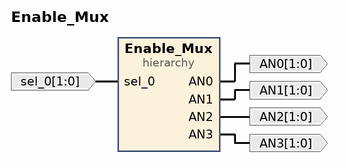
[diagram p0: block diagram of the top level]
# Vivado block design Enable_Mux, xc7a35tcpg236-1, Vivado 2018.3
create_bd_design Enable_Mux

create_bd_port -dir I -from 1 -to 0 sel_0
create_bd_port -dir O -from 1 -to 0 AN0
create_bd_port -dir O -from 1 -to 0 AN1
create_bd_port -dir O -from 1 -to 0 AN2
create_bd_port -dir O -from 1 -to 0 AN3

create_bd_cell -type hier Enable_Mux

# ---- hierarchy /Enable_Mux ----
current_bd_instance /Enable_Mux
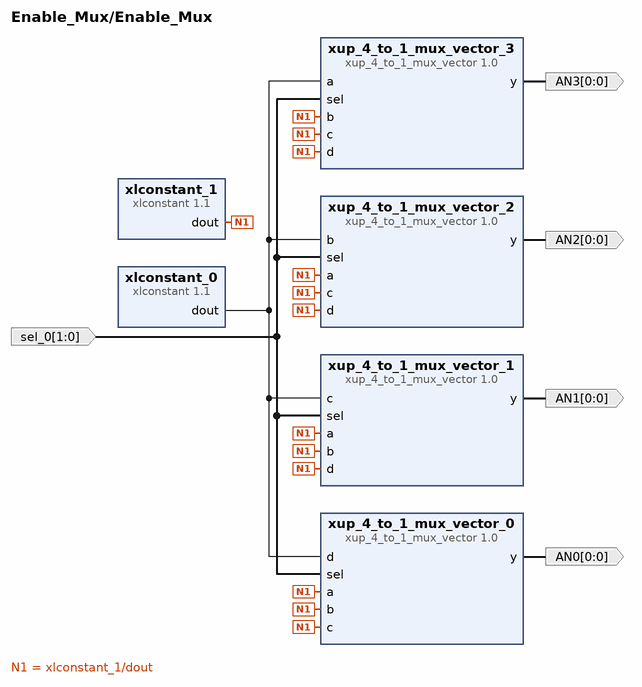
[diagram p1: block diagram inside /Enable_Mux]
create_bd_pin -dir I -from 1 -to 0 sel_0
create_bd_pin -dir O -from 0 -to 0 AN1
create_bd_pin -dir O -from 0 -to 0 AN2
create_bd_pin -dir O -from 0 -to 0 AN3
create_bd_pin -dir O -from 0 -to 0 AN0

create_bd_cell -type ip -vlnv xilinx.com:xup:xup_4_to_1_mux_vector:1.0 xup_4_to_1_mux_vector_1
set_property -dict {CONFIG.DELAY 0 CONFIG.SIZE 1} [get_bd_cells xup_4_to_1_mux_vector_1]
create_bd_cell -type ip -vlnv xilinx.com:xup:xup_4_to_1_mux_vector:1.0 xup_4_to_1_mux_vector_2
set_property -dict {CONFIG.DELAY 0 CONFIG.SIZE 1} [get_bd_cells xup_4_to_1_mux_vector_2]
create_bd_cell -type ip -vlnv xilinx.com:xup:xup_4_to_1_mux_vector:1.0 xup_4_to_1_mux_vector_3
set_property -dict {CONFIG.DELAY 0 CONFIG.SIZE 1} [get_bd_cells xup_4_to_1_mux_vector_3]
create_bd_cell -type ip -vlnv xilinx.com:ip:xlconstant:1.1 xlconstant_0
set_property -dict {CONFIG.CONST_VAL 0} [get_bd_cells xlconstant_0]
create_bd_cell -type ip -vlnv xilinx.com:ip:xlconstant:1.1 xlconstant_1
create_bd_cell -type ip -vlnv xilinx.com:xup:xup_4_to_1_mux_vector:1.0 xup_4_to_1_mux_vector_0
set_property -dict {CONFIG.DELAY 0 CONFIG.SIZE 1} [get_bd_cells xup_4_to_1_mux_vector_0]

# ---- connections ----

current_bd_instance /Enable_Mux
connect_bd_net [get_bd_pins xlconstant_1/dout] \
  [get_bd_pins xup_4_to_1_mux_vector_0/a] [get_bd_pins xup_4_to_1_mux_vector_0/b] [get_bd_pins xup_4_to_1_mux_vector_0/c] \
  [get_bd_pins xup_4_to_1_mux_vector_1/a] [get_bd_pins xup_4_to_1_mux_vector_1/b] [get_bd_pins xup_4_to_1_mux_vector_1/d] \
  [get_bd_pins xup_4_to_1_mux_vector_2/a] [get_bd_pins xup_4_to_1_mux_vector_2/c] [get_bd_pins xup_4_to_1_mux_vector_2/d] \
  [get_bd_pins xup_4_to_1_mux_vector_3/b] [get_bd_pins xup_4_to_1_mux_vector_3/c] [get_bd_pins xup_4_to_1_mux_vector_3/d]
connect_bd_net [get_bd_pins xlconstant_0/dout] \
  [get_bd_pins xup_4_to_1_mux_vector_0/d] [get_bd_pins xup_4_to_1_mux_vector_1/c] [get_bd_pins xup_4_to_1_mux_vector_2/b] \
  [get_bd_pins xup_4_to_1_mux_vector_3/a]
connect_bd_net [get_bd_pins sel_0] \
  [get_bd_pins xup_4_to_1_mux_vector_0/sel] [get_bd_pins xup_4_to_1_mux_vector_2/sel] \
  [get_bd_pins xup_4_to_1_mux_vector_3/sel] [get_bd_pins xup_4_to_1_mux_vector_1/sel]
connect_bd_net [get_bd_pins xup_4_to_1_mux_vector_1/y] [get_bd_pins AN1]
connect_bd_net [get_bd_pins xup_4_to_1_mux_vector_2/y] [get_bd_pins AN2]
connect_bd_net [get_bd_pins xup_4_to_1_mux_vector_3/y] [get_bd_pins AN3]
connect_bd_net [get_bd_pins xup_4_to_1_mux_vector_0/y] [get_bd_pins AN0]

current_bd_instance /
connect_bd_net [get_bd_ports sel_0] [get_bd_pins Enable_Mux/sel_0]
connect_bd_net -net xup_4_to_1_mux_vector_0_y [get_bd_pins Enable_Mux/AN0] [get_bd_ports AN0]
connect_bd_net -net xup_4_to_1_mux_vector_1_y [get_bd_pins Enable_Mux/AN1] [get_bd_ports AN1]
connect_bd_net -net xup_4_to_1_mux_vector_2_y [get_bd_pins Enable_Mux/AN2] [get_bd_ports AN2]
connect_bd_net -net xup_4_to_1_mux_vector_3_y [get_bd_pins Enable_Mux/AN3] [get_bd_ports AN3]

validate_bd_design
save_bd_design
